# EAGLE design final_control (EAGLE 8.2.2)
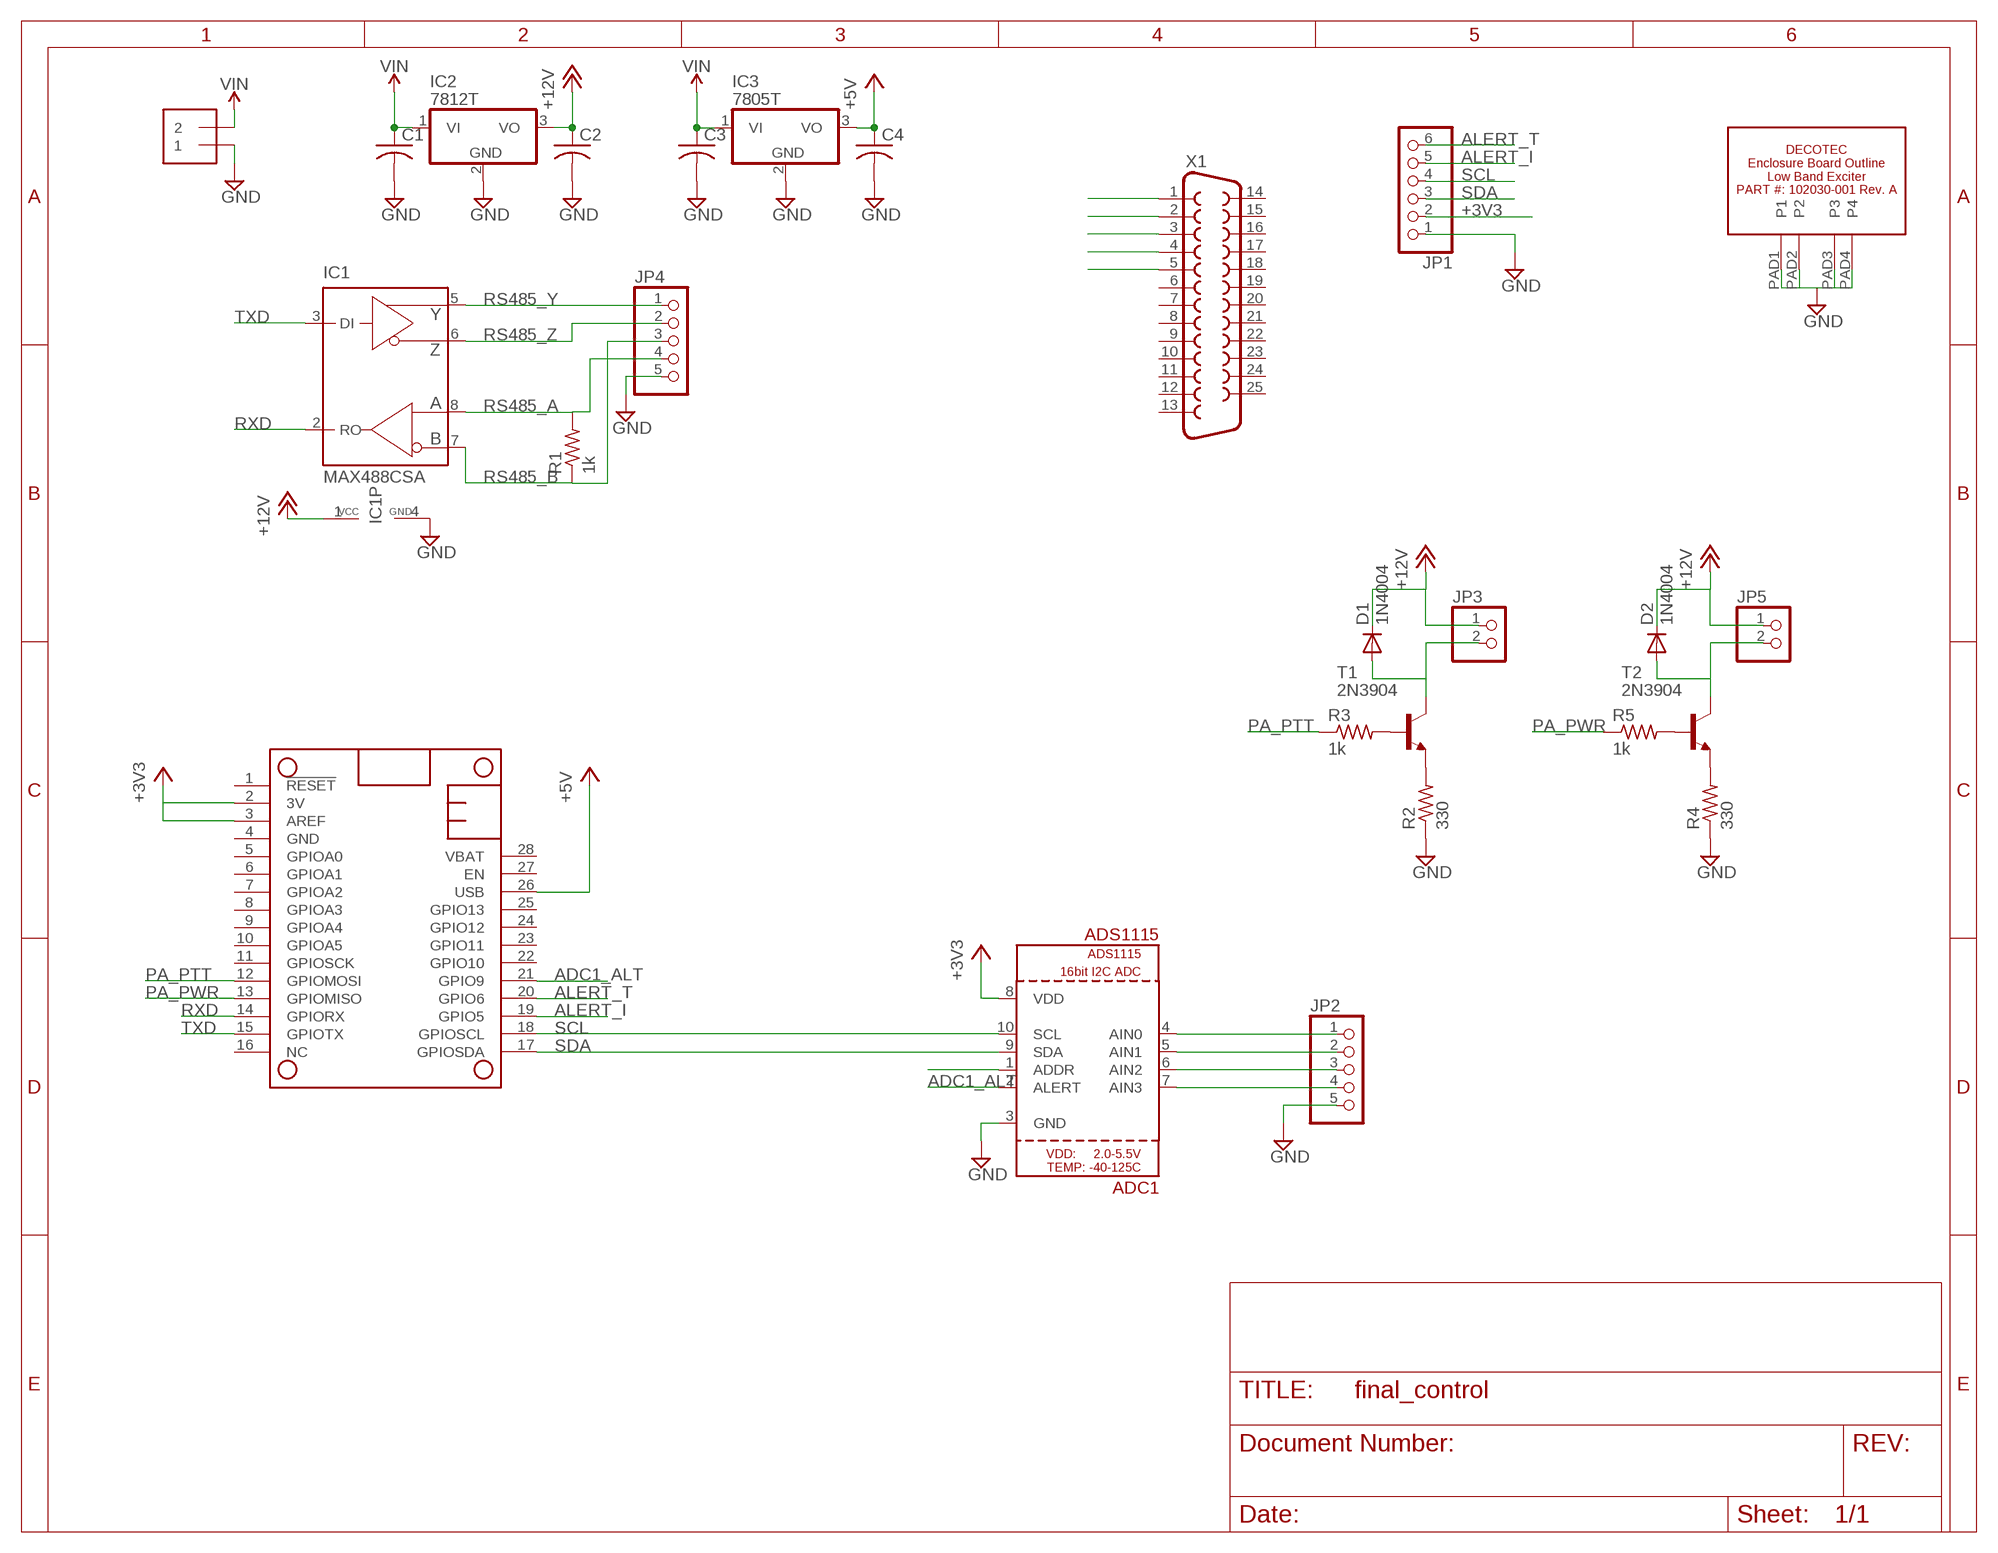
[diagram p0: schematic, sheet 1]

## Parts
ADC1  ADS1115  [MSOP10]
C1  C-USC1206K  [C1206K]
C2  C-USC1206K  [C1206K]
C3  C-USC1206K  [C1206K]
C4  C-USC1206K  [C1206K]
D1  1N4004  [DO41-10]
D2  1N4004  [DO41-10]
FEATHER_32U4  FEATHERWING_NODIM  [FEATHERWING_DIM]
IC1  MAX488CSA  [SO08]
IC2  7812T  [TO220H]
IC3  7805T  [TO220H]
J1  1X2-3.5MM  [1X2-3.5MM]
JP1  PINHD-1X6  [1X06]
JP2  PINHD-1X5  [1X05]
JP3  PINHD-1X2  [1X02]
JP4  PINHD-1X5  [1X05]
JP5  PINHD-1X2  [1X02]
R1  1k  R-US_R0805  [R0805]
R2  330  R-US_R0805  [R0805]
R3  1k  R-US_R0805  [R0805]
R4  330  R-US_R0805  [R0805]
R5  1k  R-US_R0805  [R0805]
T1  2N3904  [TO92]
T2  2N3904  [TO92]
U$2  DECOTEC_102030-001A  [DECOTEC_102030-001A]
X1  DB25_FEMALEV  [F25V]

## Nets
+3V3: ADC1.8(VDD) FEATHER_32U4.2(3V) FEATHER_32U4.3(AREF) JP1.2
+5V: C4.1 FEATHER_32U4.26(USB) IC3.3(VO)
+12V: C2.1 D1.C D2.C IC1.1(VCC) IC2.3(VO) JP3.1 JP5.1
ADC1_ALT: ADC1.2(ALERT) FEATHER_32U4.21(GPIO9)
ALERT_I: FEATHER_32U4.19(GPIO5) JP1.5
ALERT_T: FEATHER_32U4.20(GPIO6) JP1.6
GND: ADC1.3(GND) C1.2 C2.2 C3.2 C4.2 IC1.4(GND) IC2.2(GND) IC3.2(GND) J1.1 JP1.1 JP2.5 JP4.5 R2.1 R4.1 U$2.PAD1(P1) U$2.PAD2(P2) U$2.PAD3(P3) U$2.PAD4(P4)
N$1: ADC1.1(ADDR)
N$2: D2.A JP5.2 T2.1(C)
N$3: R4.2 T2.3(E)
N$4: R5.2 T2.2(B)
N$5: ADC1.4(AIN0) JP2.1
N$6: ADC1.5(AIN1) JP2.2
N$7: ADC1.6(AIN2) JP2.3
N$8: ADC1.7(AIN3) JP2.4
N$9: D1.A JP3.2 T1.1(C)
N$10: R2.2 T1.3(E)
N$11: R3.2 T1.2(B)
N$12: X1.1
N$13: X1.2
N$14: X1.3
N$15: X1.4
N$16: X1.5
PA_PTT: FEATHER_32U4.12(GPIOMOSI) R3.1
PA_PWR: FEATHER_32U4.13(GPIOMISO) R5.1
RS485_A: IC1.8(A) JP4.4 R1.2
RS485_B: IC1.7(B) JP4.3 R1.1
RS485_Y: IC1.5(Y) JP4.1
RS485_Z: IC1.6(Z) JP4.2
RXD: FEATHER_32U4.14(GPIORX) IC1.2(RO)
SCL: ADC1.10(SCL) FEATHER_32U4.18(GPIOSCL) JP1.4
SDA: ADC1.9(SDA) FEATHER_32U4.17(GPIOSDA) JP1.3
TXD: FEATHER_32U4.15(GPIOTX) IC1.3(DI)
VIN: C1.1 C3.1 IC2.1(VI) IC3.1(VI) J1.2
Unconnected: FEATHER_32U4.1(!RESET) FEATHER_32U4.5(GPIOA0) FEATHER_32U4.6(GPIOA1) FEATHER_32U4.7(GPIOA2) FEATHER_32U4.8(GPIOA3) FEATHER_32U4.9(GPIOA4) FEATHER_32U4.10(GPIOA5) FEATHER_32U4.11(GPIOSCK) FEATHER_32U4.16(NC) FEATHER_32U4.22(GPIO10) FEATHER_32U4.23(GPIO11) FEATHER_32U4.24(GPIO12) FEATHER_32U4.25(GPIO13) FEATHER_32U4.27(EN) FEATHER_32U4.28(VBAT) X1.6 X1.7 X1.8 X1.9 X1.10 X1.11 X1.12 X1.13 X1.14 X1.15 X1.16 X1.17 X1.18 X1.19 X1.20 X1.21 X1.22 X1.23 X1.24 X1.25

## Power pins joined to a net without a drawn wire
GND: FEATHER_32U4.4(GND)

## Library data of the parts
ADC1 = vtgs:ADS1115
C1-C4 = rcl:C-US: CAPACITOR, American symbol
D1 D2 = diode:1N4004: DIODE general purpose rectifier, 1 A
FEATHER_32U4 = adafruit:FEATHERWING
IC1 = maxim:MAX488: RS485 TRANSEIVER Source: Data sheet <http://datasheets.maxim-ic.com/en/ds/MAX1487-MAX491.pdf>; MF: MAXIM; MPN: MAX488CSA; OC_FARNELL: 3534170; OC_NEWARK: 34C3921
IC2 IC3 = adafruit:78*: Positive VOLTAGE REGULATOR Added bigger pads to the TO-92 package
J1 = adafruit:1X2: 3.5mm Terminal block http://www.ladyada.net/library/pcb/eaglelibrary.html
JP1 = pinhead:PINHD-1X6: PIN HEADER
JP2 JP4 = pinhead:PINHD-1X5: PIN HEADER
JP3 JP5 = pinhead:PINHD-1X2: PIN HEADER
R1-R5 = resistor:R-US_: RESISTOR, American symbol
T1 T2 = transistor:2N3904: NPN TRANSISTOR
U$2 = vtgs:DECOTEC_102030-001A
X1 = SparkFun-Retired:DB25_FEMALE: 25 Pin male connector. PCB edge mount for regular PCB thicknesses. This connector will connect directly to the back of a PC parallel port or through a normal DB25 extension cable (M/F). SKU: PRT-08287

## Board
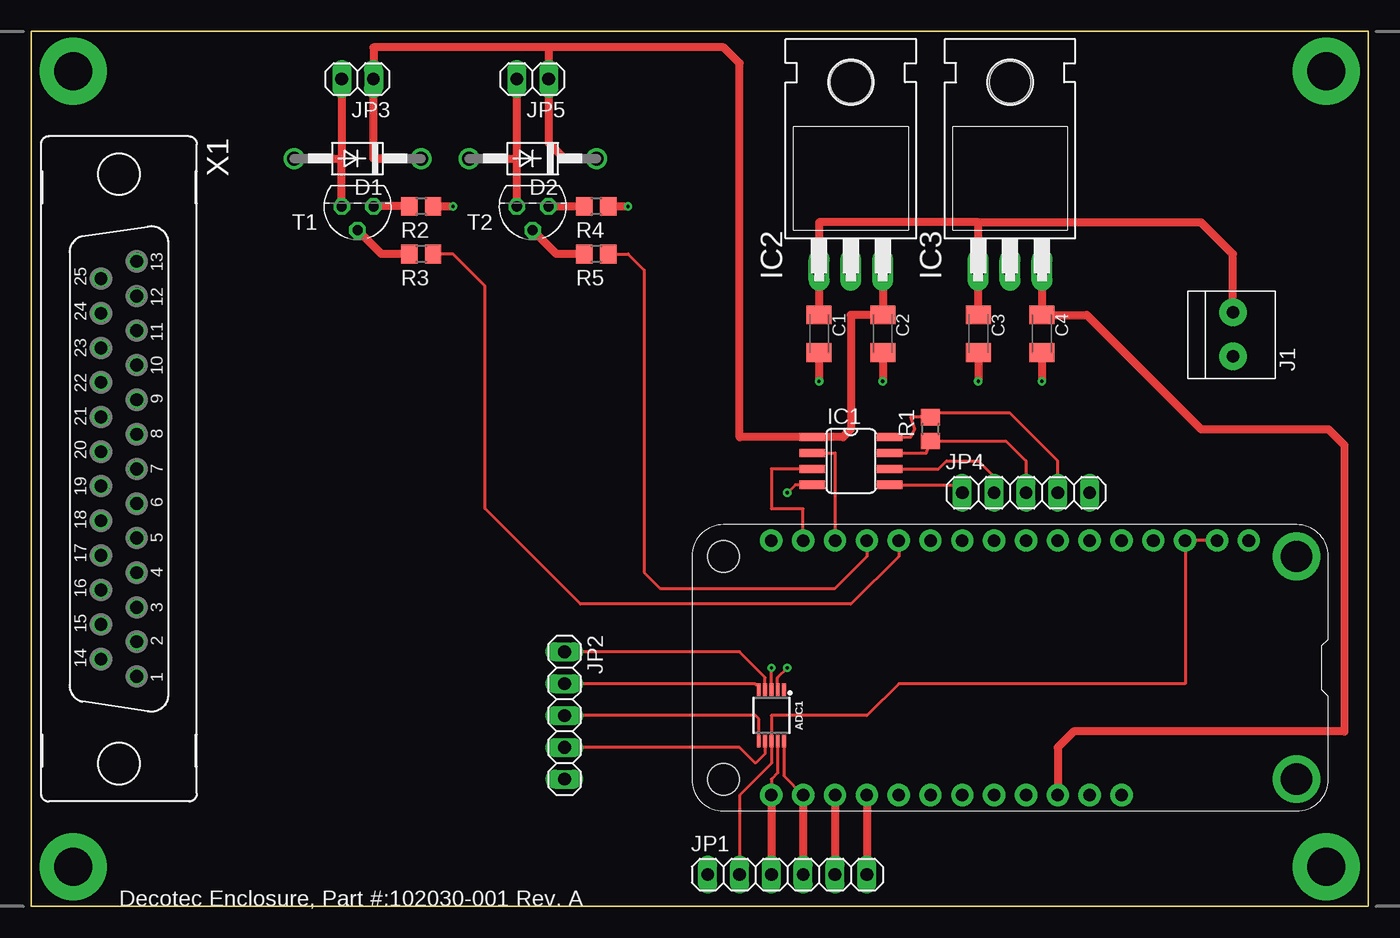
[diagram p1: board, top side]
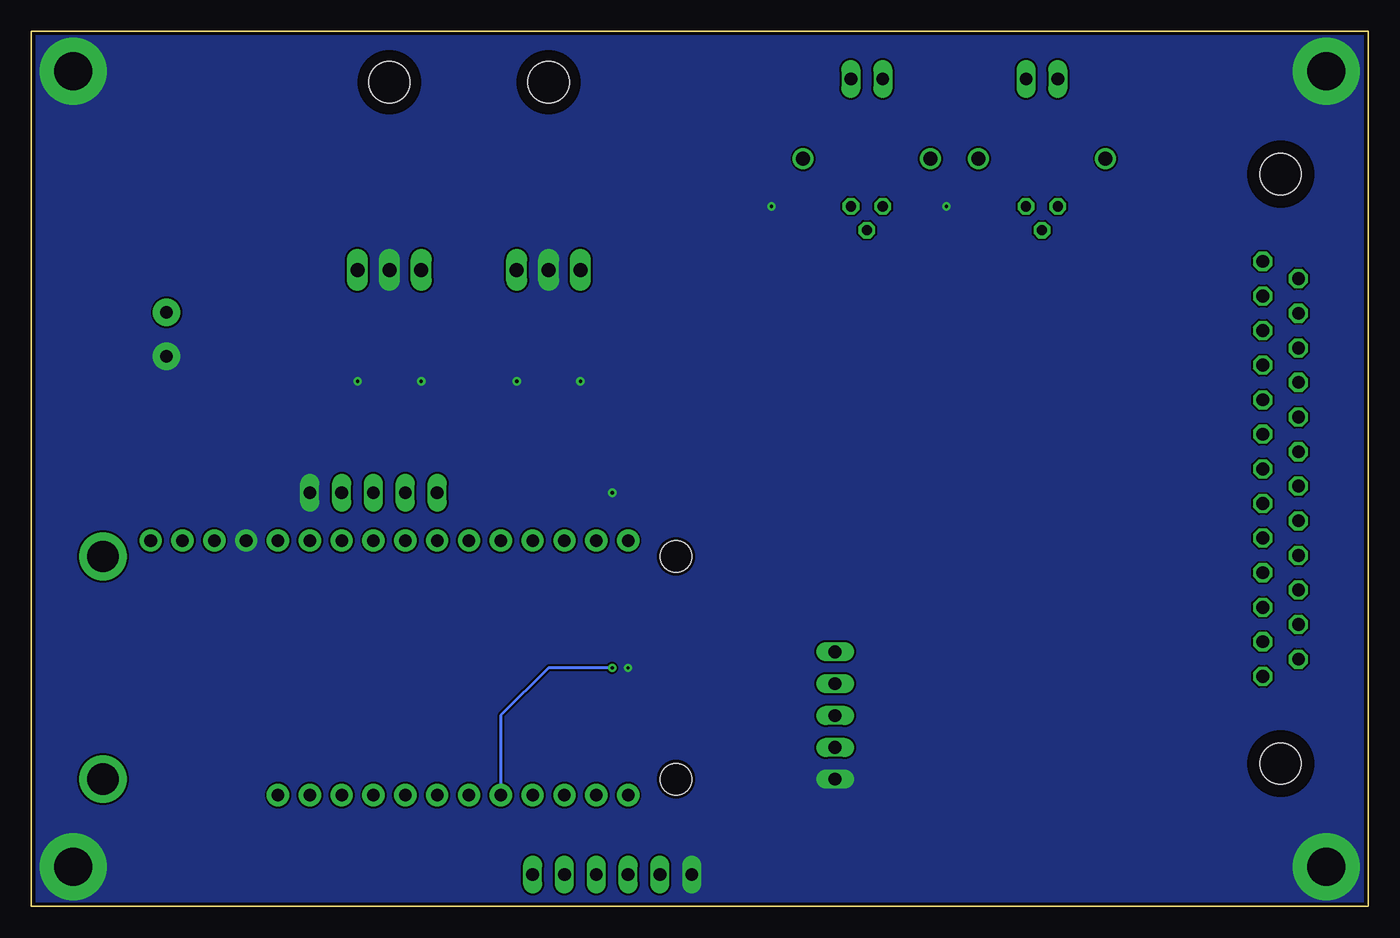
[diagram p2: board, bottom side, seen from below]

Size 106.68 x 69.85 mm. Coordinates in mm from the lower left corner, seen from the top.
Copper layers (1*16): Top 0.035mm / dielectric 1.5mm / Bottom 0.035mm
Design rules "default *": minimum track width 6mil, minimum drill 10mil, track to track 6mil, track to pad 6mil, pad to pad 6mil, via to via 6mil, smd to smd 6mil, copper to edge 10mil, drill to drill 6mil, minimum pad ring 10mil, minimum via ring 8mil, stop-mask expansion 4mil, vias tented up to drill 0mil, thermal gap 10mil

### Footprints (pad centres in the part's own frame; a part is rotated, then mirrored left to right if it is on the bottom)
MSOP10 = smd 0.3 x 1: 1 -1,-2.05; 2 -0.5,-2.05; 3 0,-2.05; 4 0.5,-2.05; 5 1,-2.05; 6 1,2.05; 7 0.5,2.05; 8 0,2.05; 9 -0.5,2.05; 10 -1,2.05
C1206K = smd 1.5 x 2: 1 -1.5,0; 2 1.5,0
DO41-10 = drill 1.118: A 5.08,0; C -5.08,0
FEATHERWING_DIM = drill 1 pad 1.778: 1 6.35,1.27; 2 8.89,1.27; 3 11.43,1.27; 4 13.97,1.27; 5 16.51,1.27; 6 19.05,1.27; 7 21.59,1.27; 8 24.13,1.27; 9 26.67,1.27; 10 29.21,1.27; 11 31.75,1.27; 12 34.29,1.27; 13 36.83,1.27; 14 39.37,1.27; 15 41.91,1.27; 16 44.45,1.27; 17 44.45,21.59; 18 41.91,21.59; 19 39.37,21.59; 20 36.83,21.59; 21 34.29,21.59; 22 31.75,21.59; 23 29.21,21.59; 24 26.67,21.59; 25 24.13,21.59; 26 21.59,21.59; 27 19.05,21.59; 28 16.51,21.59 | drill 2.5 pad 3.81: P$1 2.54,20.32; P$2 2.54,2.54 | hole 2.54: 48.26,20.32; 48.26,2.54
SO08 = smd 0.66 x 2.032: 1 -1.905,-3.073; 2 -0.635,-3.073; 3 0.635,-3.073; 4 1.905,-3.073; 5 1.905,3.073; 6 0.635,3.073; 7 -0.635,3.073; 8 -1.905,3.073
TO220H = drill 1.118 long: 1 -2.54,-10.16; 2 0,-10.16; 3 2.54,-10.16 | hole 3.302: 0,4.826
1X2-3.5MM = drill 1 pad 2.184: 1 1.8,0; 2 -1.7,0
1X06 = drill 1.016 long: 1 -6.35,0; 2 -3.81,0; 3 -1.27,0; 4 1.27,0; 5 3.81,0; 6 6.35,0
1X05 = drill 1.016 long: 1 -5.08,0; 2 -2.54,0; 3 0,0; 4 2.54,0; 5 5.08,0
1X02 = drill 1.016 long: 1 -1.27,0; 2 1.27,0
R0805 = smd 1.3 x 1.5: 1 -0.95,0; 2 0.95,0
TO92 = drill 0.813 octagon: 1 1.27,0; 2 0,1.905; 3 -1.27,0
DECOTEC_102030-001A = drill 3.048 pad 5.334: PAD1 10.319,3.175; PAD2 10.319,66.675; PAD3 110.331,66.675; PAD4 110.331,3.175
F25V = drill 1.016 octagon: 1 16.561,1.422; 2 13.792,1.422; 3 11.049,1.422; 4 8.28,1.422; 5 5.512,1.422; 6 2.769,1.422; 7 0,1.422; 8 -2.769,1.422; 9 -5.512,1.422; 10 -8.28,1.422; 11 -11.049,1.422; 12 -13.792,1.422; 13 -16.561,1.422; 14 15.189,-1.422; 15 12.421,-1.422; 16 9.652,-1.422; 17 6.909,-1.422; 18 4.14,-1.422; 19 1.372,-1.422; 20 -1.372,-1.422; 21 -4.14,-1.422; 22 -6.909,-1.422; 23 -9.652,-1.422; 24 -12.421,-1.422; 25 -15.189,-1.422 | hole 3.302: 23.52,0; -23.52,0

### Placement (x,y rotation side)
ADC1  59.06,15.24 180 top
C1  62.86,45.72 270 top
C2  67.95,45.72 270 top
C3  75.56,45.72 270 top
C4  80.64,45.72 270 top
D1  26.04,59.69 180 top
D2  40.01,59.69 180 top
FEATHER_32U4  103.5,30.48 180 top
IC1  65.41,35.56 270 top
IC2  65.41,60.96 0 top
IC3  78.11,60.96 0 top
J1  95.89,45.72 270 top
JP1  60.33,2.54 0 top
JP2  42.55,15.24 270 top
JP3  26.04,66.04 180 top
JP4  79.38,33.02 0 top
JP5  40.01,66.04 180 top
R1  71.75,38.1 90 top
R2  31.12,55.88 180 top
R3  31.12,52.07 180 top
R4  45.09,55.88 180 top
R5  45.09,52.07 180 top
T1  26.04,55.88 180 top
T2  40.01,55.88 180 top
U$2  -6.99,0 0 top
X1  6.99,34.92 270 top

### Tracks (layer width: path | path; a pad name or v marks a point on that pad's centre or on a via)
+3V3
  Top 0.254: FEATHER_32U4.2 FEATHER_32U4.3 92.08,17.78 69.22,17.78 66.67,15.24 59.06,15.24 ADC1.8 59.06,11.43 56.52,8.89 JP1.2
+5V
  Top 0.635: IC3.3 C4.1 84.22,47.22 93.34,38.1 103.5,38.1 104.78,36.83 104.78,13.97 83.19,13.97 81.92,12.7 FEATHER_32U4.26
+12V
  Top 0.635: IC2.3 C2.1 65.41,47.22 65.41,38.1 64.77,37.47 IC1.1 56.52,37.47 56.52,67.31 55.24,68.58 41.27,68.58 | 31.08,59.73 27.3,59.69 | 31.08,59.73 D1.C | 41.27,68.58 27.3,68.58 JP3.1 27.3,59.69 | 27.3,59.69 31.08,59.69 31.08,59.73 | D2.C 42.55,59.69 41.27,60.96 JP5.1 41.27,68.58
ADC1_ALT  (via drill 0.25)
  Top 0.254: ADC1.2 59.56,18.28 v60.33,19.05
  Bottom 0.254: v60.33,19.05 65.41,19.05 69.22,15.24 FEATHER_32U4.21
ALERT_I
  Top 0.635: FEATHER_32U4.19 JP1.5
ALERT_T
  Top 0.635: FEATHER_32U4.20 JP1.6
GND  (via drill 0.25)
  Top 0.254: IC1.4 60.96,33.66 v60.33,33.02 | ADC1.3 v59.06,19.05
  Top 0.635: C1.2 v62.86,41.91 | C2.2 v67.95,41.91 | C3.2 v75.56,41.91 | C4.2 v80.64,41.91 | R2.1 v33.66,55.88 | R4.1 v47.62,55.88
  pour Bottom (no thermals): -0.64,69.85 107.31,69.85 107.31,0 -0.64,0
N$2
  Top 0.635: JP5.2 38.73,59.79 | 38.73,59.79 38.73,59.69 | D2.A 38.64,59.69 38.73,59.79 | 38.73,59.79 T2.1
N$3
  Top 0.635: T2.3 R4.2
N$4
  Top 0.635: R5.2 41.91,52.07 T2.2
N$5
  Top 0.254: ADC1.4 58.56,18.28 56.52,20.32 JP2.1
N$6
  Top 0.254: JP2.2 57.78,17.78 58.06,17.51 ADC1.5
N$7
  Top 0.254: ADC1.6 58.06,14.97 57.78,15.24 JP2.3
N$8
  Top 0.254: ADC1.7 58.56,12.2 57.78,11.43 56.52,12.7 JP2.4
N$9
  Top 0.635: T1.1 24.77,59.69 | D1.A 24.77,59.69 | JP3.2 24.77,59.69
N$10
  Top 0.635: R2.2 T1.3
N$11
  Top 0.635: R3.2 27.94,52.07 T1.2
PA_PTT
  Top 0.254: FEATHER_32U4.12 69.22,27.94 65.41,24.13 43.81,24.13 36.2,31.75 36.2,49.53 33.66,52.07 R3.1
PA_PWR
  Top 0.254: FEATHER_32U4.13 66.67,27.94 64.14,25.4 50.16,25.4 48.9,26.67 48.9,50.8 47.62,52.07 R5.1
RS485_A
  Top 0.254: IC1.8 70.17,37.47 70.48,38.1 70.17,39.05 R1.2 72.08,39.37 78.11,39.37 81.92,35.56 JP4.4
RS485_B
  Top 0.254: IC1.7 71.44,36.2 R1.1 77.78,37.15 79.38,35.56 JP4.3
RS485_Y
  Top 0.254: IC1.5 73.66,33.66 JP4.1
RS485_Z
  Top 0.254: IC1.6 72.39,34.92 73.03,35.56 75.56,35.56 76.83,34.29 JP4.2
RXD
  Top 0.254: IC1.2 64.14,36.2 FEATHER_32U4.14
SCL
  Top 0.254: ADC1.10 60.06,10.43 FEATHER_32U4.18
  Top 0.635: FEATHER_32U4.18 JP1.4
SDA
  Top 0.254: ADC1.9 59.56,10.66 59.06,10.16 FEATHER_32U4.17
  Top 0.635: FEATHER_32U4.17 JP1.3
TXD
  Top 0.254: FEATHER_32U4.15 61.59,31.75 59.06,31.75 59.06,34.92 IC1.3
VIN
  Top 0.635: J1.2 95.89,52.07 93.34,54.61 75.56,54.61 | 75.56,54.61 IC3.1 C3.1 | 75.56,54.61 62.86,54.61 IC2.1 C1.1